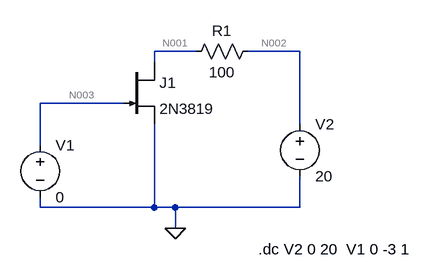
[diagram p0: schematic Draft4.asc]
Draft4.asc, the LTspice schematic file:
Version 4
SHEET 1 880 680
WIRE 272 16 208 16
WIRE 432 16 352 16
WIRE 208 32 208 16
WIRE 160 96 32 96
WIRE 432 128 432 16
WIRE 32 160 32 96
WIRE 32 256 32 240
WIRE 208 256 208 128
WIRE 208 256 32 256
WIRE 240 256 208 256
WIRE 432 256 432 208
WIRE 432 256 240 256
WIRE 240 288 240 256
FLAG 240 288 0
SYMBOL voltage 32 144 R0
WINDOW 123 0 0 Left 0
WINDOW 39 0 0 Left 0
SYMATTR InstName V1
SYMATTR Value 0
SYMBOL voltage 432 112 R0
WINDOW 123 0 0 Left 0
WINDOW 39 0 0 Left 0
SYMATTR InstName V2
SYMATTR Value 20
SYMBOL res 368 0 R90
WINDOW 0 0 56 VBottom 2
WINDOW 3 32 56 VTop 2
SYMATTR InstName R1
SYMATTR Value 100
SYMBOL njf 160 32 R0
SYMATTR InstName J1
SYMATTR Value 2N3819
TEXT 368 320 Left 2 !.dc V2 0 20  V1 0 -3 1

The netlist it stands for:
* Draft4.asc
V1 N003 0 0
V2 N002 0 20
R1 N002 N001 100
J1 N001 N003 0 2N3819
.model NJF NJF
.model PJF PJF
.lib standard.jft
.dc V2 0 20  V1 0 -3 1
.backanno
.end

* Results of the author's LTspice run, read from the files saved beside the schematic
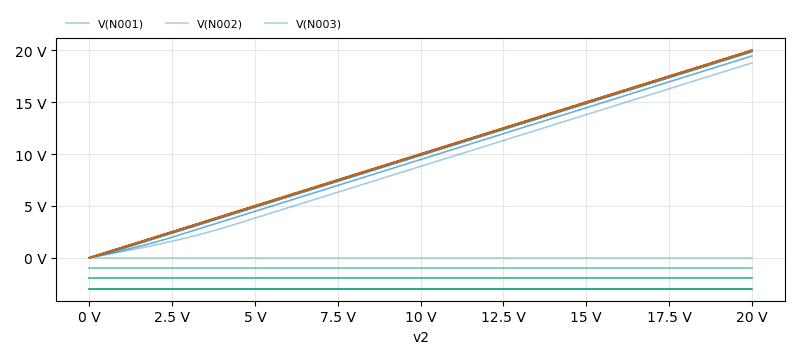
[diagram p1: DC transfer characteristic of Draft4.asc, plotted from the saved traces]
* DC transfer characteristic, 4 runs:
*   V(N001) [v1=0]: 0 V at v2=0 V, 18.79 V at v2=20 V, min 0 V, max 18.79 V
*   V(N001) [v1=-1]: -95.51 pV at v2=0 V, 19.46 V at v2=20 V, min -95.51 pV, max 19.46 V
*   V(N001) [v1=-2]: -199.6 pV at v2=0 V, 19.86 V at v2=20 V, min -199.6 pV, max 19.86 V
*   V(N001) [v1=-3]: -356.6 pV at v2=0 V, 20 V at v2=20 V, min -356.6 pV, max 20 V
*   V(N002) [v1=0]: 0 V at v2=0 V, 20 V at v2=20 V, min 0 V, max 20 V
*   V(N002) [v1=-1]: 0 V at v2=0 V, 20 V at v2=20 V, min 0 V, max 20 V
*   V(N002) [v1=-2]: 0 V at v2=0 V, 20 V at v2=20 V, min 0 V, max 20 V
*   V(N002) [v1=-3]: 0 V at v2=0 V, 20 V at v2=20 V, min 0 V, max 20 V
*   V(N003) [v1=0]: 0 V at v2=0 V, 0 V at v2=20 V, min 0 V, max 0 V
*   V(N003) [v1=-1]: -1 V at v2=0 V, -1 V at v2=20 V, min -1 V, max -1 V
*   V(N003) [v1=-2]: -2 V at v2=0 V, -2 V at v2=20 V, min -2 V, max -2 V
*   V(N003) [v1=-3]: -3 V at v2=0 V, -3 V at v2=20 V, min -3 V, max -3 V